# EAGLE design rs485if (EAGLE 6.5.0)
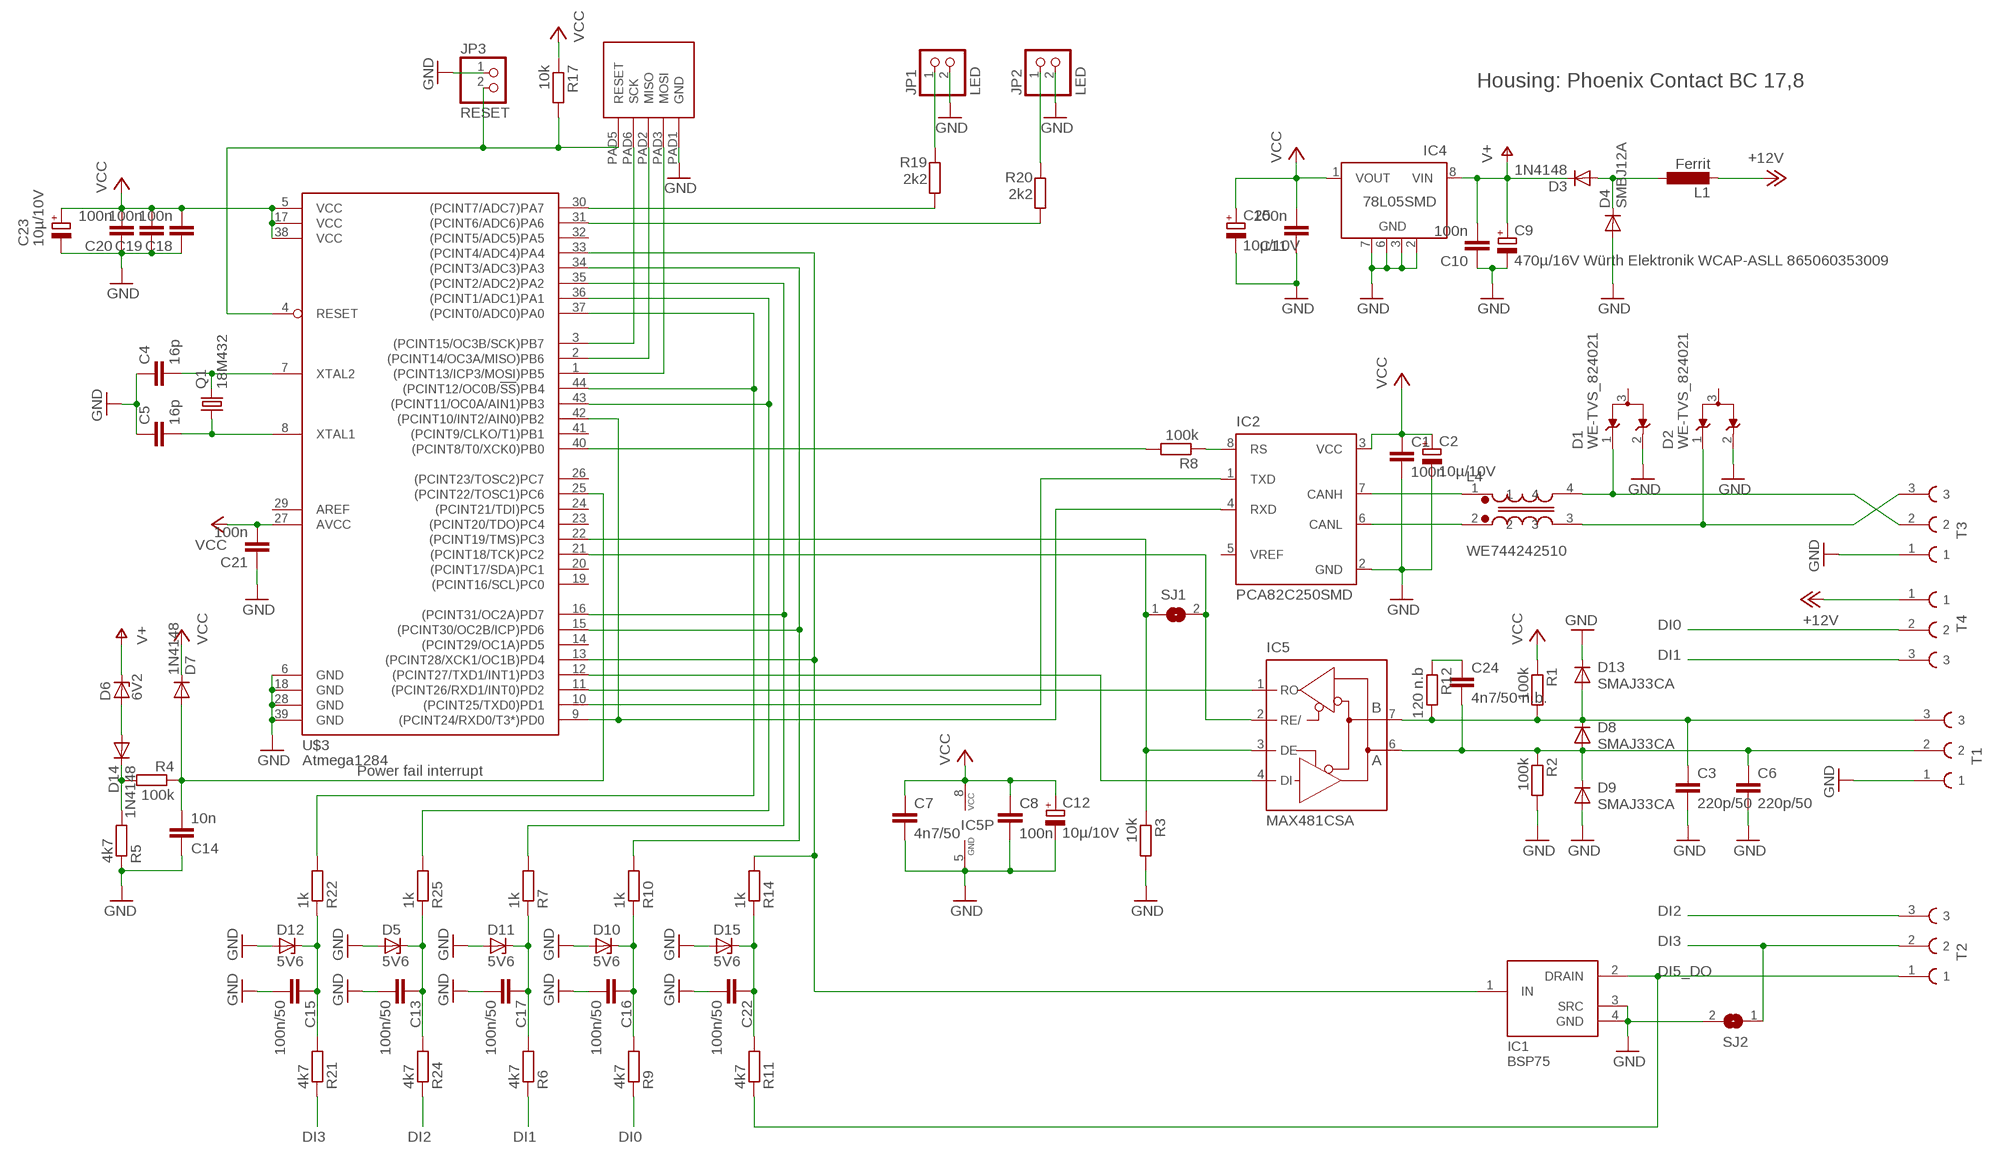
[diagram p0: schematic, sheet 1]

## Parts
C1  100n  C-EUC0603  [C0603]
C2  10µ/10V  CPOL-EUA/3216-18W  [A/3216-18W]
C3  220p/50  C-EUC0603  [C0603]
C4  16p  C-EUC0603  [C0603]
C5  16p  C-EUC0603  [C0603]
C6  220p/50  C-EUC0603  [C0603]
C7  4n7/50  C-EUC0603  [C0603]
C8  100n  C-EUC0603  [C0603]
C9  470µ/16V Würth Elektronik WCAP-ASLL 865060353009  CPOL-EUSANYO_SMD_E7  [SANYO-OSCON_SMD_E7]
C10  100n  C-EUC0603  [C0603]
C11  100n  C-EUC0603  [C0603]
C12  10µ/10V  CPOL-EUA/3216-18W  [A/3216-18W]
C13  100n/50  C-EUC0603  [C0603]
C14  10n  C-EUC0603  [C0603]
C15  100n/50  C-EUC0603  [C0603]
C16  100n/50  C-EUC0603  [C0603]
C17  100n/50  C-EUC0603  [C0603]
C18  100n  C-EUC0603  [C0603]
C19  100n  C-EUC0603  [C0603]
C20  100n  C-EUC0603  [C0603]
C21  100n  C-EUC0603  [C0603]
C22  100n/50  C-EUC0603  [C0603]
C23  10µ/10V  CPOL-EUA/3216-18W  [A/3216-18W]
C24  4n7/50 n.b.  C-EUC0603  [C0603]
C25  10µ/10V  CPOL-EUA/3216-18W  [A/3216-18W]
D1  WE-TVS_824021  [WE-TVS_SOT23-3L]
D2  WE-TVS_824021  [WE-TVS_SOT23-3L]
D3  1N4148  DIODE-SOD80C  [SOD80C]
D4  SMBJ12A  DIODE-SMB  [SMB]
D5  5V6  ZENER-DIODESOD80C  [SOD80C]
D6  6V2  ZENER-DIODESOD80C  [SOD80C]
D7  1N4148  DIODE-SOD80C  [SOD80C]
D8  SMAJ33CA  DIODE-DO214AC  [DO214AC]
D9  SMAJ33CA  DIODE-DO214AC  [DO214AC]
D10  5V6  ZENER-DIODESOD80C  [SOD80C]
D11  5V6  ZENER-DIODESOD80C  [SOD80C]
D12  5V6  ZENER-DIODESOD80C  [SOD80C]
D13  SMAJ33CA  DIODE-DO214AC  [DO214AC]
D14  1N4148  DIODE-SOD80C  [SOD80C]
D15  5V6  ZENER-DIODESOD80C  [SOD80C]
IC1  BSP75  [SOT223]
IC2  PCA82C250SMD  [SO8]
IC4  78L05SMD  [SO08]
IC5  MAX481CSA  [SO08]
JP1  LED  PINHD-1X2  [1X02]
JP2  LED  PINHD-1X2  [1X02]
JP3  RESET  PINHD-1X2  [1X02]
L1  Ferrit  L-EUL1806  [L1806]
L4  WE744242510  WE-SLM  [WE-SLM]
Q1  18M432  CRYSTALSM49  [SM49]
R1  100k  R-EU_R0603  [R0603]
R2  100k  R-EU_R0603  [R0603]
R3  10k  R-EU_R0603  [R0603]
R4  100k  R-EU_R0603  [R0603]
R5  4k7  R-EU_R0603  [R0603]
R6  4k7  R-EU_R0603  [R0603]
R7  1k  R-EU_R0603  [R0603]
R8  100k  R-EU_R0603  [R0603]
R9  4k7  R-EU_R0603  [R0603]
R10  1k  R-EU_R0603  [R0603]
R11  4k7  R-EU_R0603  [R0603]
R12  120 n.b  R-EU_R0603  [R0603]
R14  1k  R-EU_R0603  [R0603]
R17  10k  R-EU_R0603  [R0603]
R19  2k2  R-EU_R0603  [R0603]
R20  2k2  R-EU_R0603  [R0603]
R21  4k7  R-EU_R0603  [R0603]
R22  1k  R-EU_R0603  [R0603]
R24  4k7  R-EU_R0603  [R0603]
R25  1k  R-EU_R0603  [R0603]
SJ1  SJ  [SJ]
SJ2  SJ  [SJ]
T1  MKDSO_2.5/3_R  [PHOENIX_MKDSO_2.5/3_R]
T2  MKDSO_2.5/3_R  [PHOENIX_MKDSO_2.5/3_R]
T3  MKDSO_2.5/3_L  [PHOENIX_MKDSO_2.5/3_L]
T4  MKDSO_2.5/3_L  [PHOENIX_MKDSO_2.5/3_L]
U$1  ATMEL_ISP  [ATMEL_ISP]
U$3  Atmega1284  ATMEGA644  [TQFP44]

## Nets
#RESET: JP3.2 R17.2 U$1.PAD5(RESET) U$3.4(RESET)
+12V: L1.2 T4.1
A: C6.1 C24.2 D8.A D9.C IC5.6(A) R2.1 T1.2
B: C3.1 D8.C D13.A IC5.7(B) R1.2 R12.2 T1.3
B+: D1.1 L4.4 T3.2
B-: D2.1 L4.3 T3.3
DI0: R9.1 T4.2
DI1: R6.1 T4.3
DI2: R24.1 T2.3
DI3: R21.1 SJ2.1 T2.2
DI5_DO: IC1.2(DRAIN) R11.1 T2.1
GND: C1.2 C2.- C3.2 C4.1 C5.1 C6.2 C7.2 C8.2 C9.- C10.1 C11.1 C12.- C13.2 C14.1 C15.2 C16.2 C17.2 C18.1 C19.1 C20.1 C21.1 C22.2 C23.- C25.- D1.2 D2.2 D4.A D5.A D9.A D10.A D11.A D12.A D13.C D15.A IC1.3(SRC) IC1.4(GND) IC2.2(GND) IC4.2(GND) IC4.3(GND) IC4.6(GND) IC4.7(GND) IC5.5(GND) JP1.2 JP2.2 JP3.1 R2.2 R3.2 R5.1 SJ2.2 T1.1 T3.1 U$1.PAD1(GND) U$3.6(GND) U$3.18(GND) U$3.28(GND) U$3.39(GND)
N$1: R8.2 U$3.40((PCINT8/T0/XCK0)PB0)
N$2: C24.1 R12.1
N$3: IC2.1(TXD) U$3.10((PCINT25/TXD0)PD1)
N$5: U$1.PAD3(MOSI) U$3.1((PCINT13/ICP3/MOSI)PB5)
N$6: U$1.PAD2(MISO) U$3.2((PCINT14/OC3A/MISO)PB6)
N$7: U$1.PAD6(SCK) U$3.3((PCINT15/OC3B/SCK)PB7)
N$8: IC1.1(IN) R14.2 U$3.13((PCINT28/XCK1/OC1B)PD4) U$3.33((PCINT4/ADC4)PA4)
N$9: C13.1 D5.C R24.2 R25.1
N$10: IC2.7(CANH) L4.1
N$11: IC5.4(DI) U$3.12((PCINT27/TXD1/INT1)PD3)
N$12: IC2.4(RXD) U$3.9((PCINT24/RXD0/T3*)PD0) U$3.42((PCINT10/INT2/AIN0)PB2)
N$13: IC5.1(RO) U$3.11((PCINT26/RXD1/INT0)PD2)
N$14: IC5.3(DE) R3.1 SJ1.1 U$3.22((PCINT19/TMS)PC3)
N$15: C4.2 Q1.2 U$3.7(XTAL2)
N$16: C5.2 Q1.1 U$3.8(XTAL1)
N$17: IC2.6(CANL) L4.2
N$18: C15.1 D12.C R21.2 R22.1
N$19: C16.1 D10.C R9.2 R10.1
N$20: D3.A D4.C L1.1
N$21: C17.1 D11.C R6.2 R7.1
N$22: D6.A D14.A
N$23: JP2.1 R20.1
N$24: R19.2 U$3.30((PCINT7/ADC7)PA7)
N$25: R20.2 U$3.31((PCINT6/ADC6)PA6)
N$26: IC5.2(RE/) SJ1.2 U$3.21((PCINT18/TCK)PC2)
N$27: IC2.8(RS) R8.1
N$28: D14.C R4.2 R5.2
N$29: C22.1 D15.C R11.2 R14.1
N$33: R10.2 U$3.15((PCINT30/OC2B/ICP)PD6) U$3.34((PCINT3/ADC3)PA3)
N$34: R7.2 U$3.16((PCINT31/OC2A)PD7) U$3.35((PCINT2/ADC2)PA2)
N$35: R25.2 U$3.36((PCINT1/ADC1)PA1) U$3.43((PCINT11/OC0A/AIN1)PB3)
N$36: R22.2 U$3.37((PCINT0/ADC0)PA0) U$3.44((PCINT12/OC0B/!SS!)PB4)
N$37: JP1.1 R19.1
N$39: C14.2 D7.A R4.1 U$3.25((PCINT22/TOSC1)PC6)
V+: C9.+ C10.2 D3.C D6.C IC4.8(VIN)
VCC: C1.1 C2.+ C7.1 C8.1 C11.2 C12.+ C18.2 C19.2 C20.2 C21.2 C23.+ C25.+ D7.C IC2.3(VCC) IC4.1(VOUT) IC5.8(VCC) R1.1 R17.1 U$3.5(VCC) U$3.17(VCC) U$3.27(AVCC) U$3.38(VCC)
Unconnected: D1.3(GND) D2.3(GND) IC2.5(VREF) IC4.4(NC) IC4.5(NC) U$3.14((PCINT29/OC1A)PD5) U$3.19((PCINT16/SCL)PC0) U$3.20((PCINT17/SDA)PC1) U$3.23((PCINT20/TDO)PC4) U$3.24((PCINT21/TDI)PC5) U$3.26((PCINT23/TOSC2)PC7) U$3.29(AREF) U$3.32((PCINT5/ADC5)PA5) U$3.41((PCINT9/CLKO/T1)PB1)

## Notes on the sheet
- Housing: Phoenix Contact BC 17,8
- Power fail interrupt

## Library data of the parts
C1 C3-C8 C10 C11 C13-C22 C24 = resistor:C-EU: CAPACITOR, European symbol
C2 C9 C12 C23 C25 = rcl:CPOL-EU: POLARIZED CAPACITOR, European symbol
D1 D2 = EagleLibrary_Wuerth_Elektronik_eiSos_V6_20140807:WE-TVS_824021: TVS Diode Array WE-TVS, Standard Series - Low capazity - No leakage current - Low clamping voltage - high ESD voltage protection - Uni- and bidirectional protection -- DC Distribution -- Headsets and Accessoires -- PDAs -- Digital Cameras -- MP3-Players -- Touch Panels <http://katalog.we-online.de/media/images/eisos/VarTVS_highspeed_pf2.jpg.jpg> Details see: http://katalog.we-online.de/en/pbs/WE-TVS_High_Speed? Updated by Dan Xu 2014-07-11 2014 (C) Würth Elektronik
D3 D4 D7-D9 D13 D14 = diode:DIODE-: DIODE
D5 D6 D10-D12 D15 = diode:ZENER-DIODE: Z-Diode
IC1 = mylib:BSP75
IC2 = mylib:PCA82C250: CAN CONTROLLER INTERFACE
IC4 = linear:78L*SMD: Positive VOLTAGE REGULATOR
IC5 = maxim:MAX481CSA: RS485 TRANSEIVER; MF: MAXIM; MPN: MAX481CSA; OC_FARNELL: unknown; OC_NEWARK: 90C3817
JP1-JP3 = pinhead:PINHD-1X2: PIN HEADER
L1 = mylib:L-EU: INDUCTOR, European symbol
L4 = EagleLibrary_Wuerth_Elektronik_eiSos_V6_20140807:WE-SLM: SMD Common Mode Line Filter WE-SLM - Small size - Low Profile - High Impedance - High current capability up to 300 mA -- USB -- CAN -- Firewire -- Data Lines -- Power supply systems -- Signal Lines <http://katalog.we-online.de/media/images/eisos/IndSLM_pf2.jpg> Details see: http://katalog.we-online.de/en/pbs/WE-SLM?? Updated by Dan Xu 2014-07-11 2014 (C) Würth Elektronik
Q1 = crystal:CRYSTAL: CRYSTAL; OC_FARNELL: unknown; OC_NEWARK: unknown
R1-R12 R14 R17 R19-R22 R24 R25 = resistor:R-EU_: RESISTOR, European symbol
SJ1 SJ2 = jumper:SJ: SMD solder JUMPER
T1 T2 = mylib:MKDSO_2.5/3_R
T3 T4 = mylib:MKDSO_2.5/3_L
U$1 = mylib:ATMEL_ISP
U$3 = mylib:ATMEGA644

## Net classes
0 default: clearance 0.205 mm

## Board
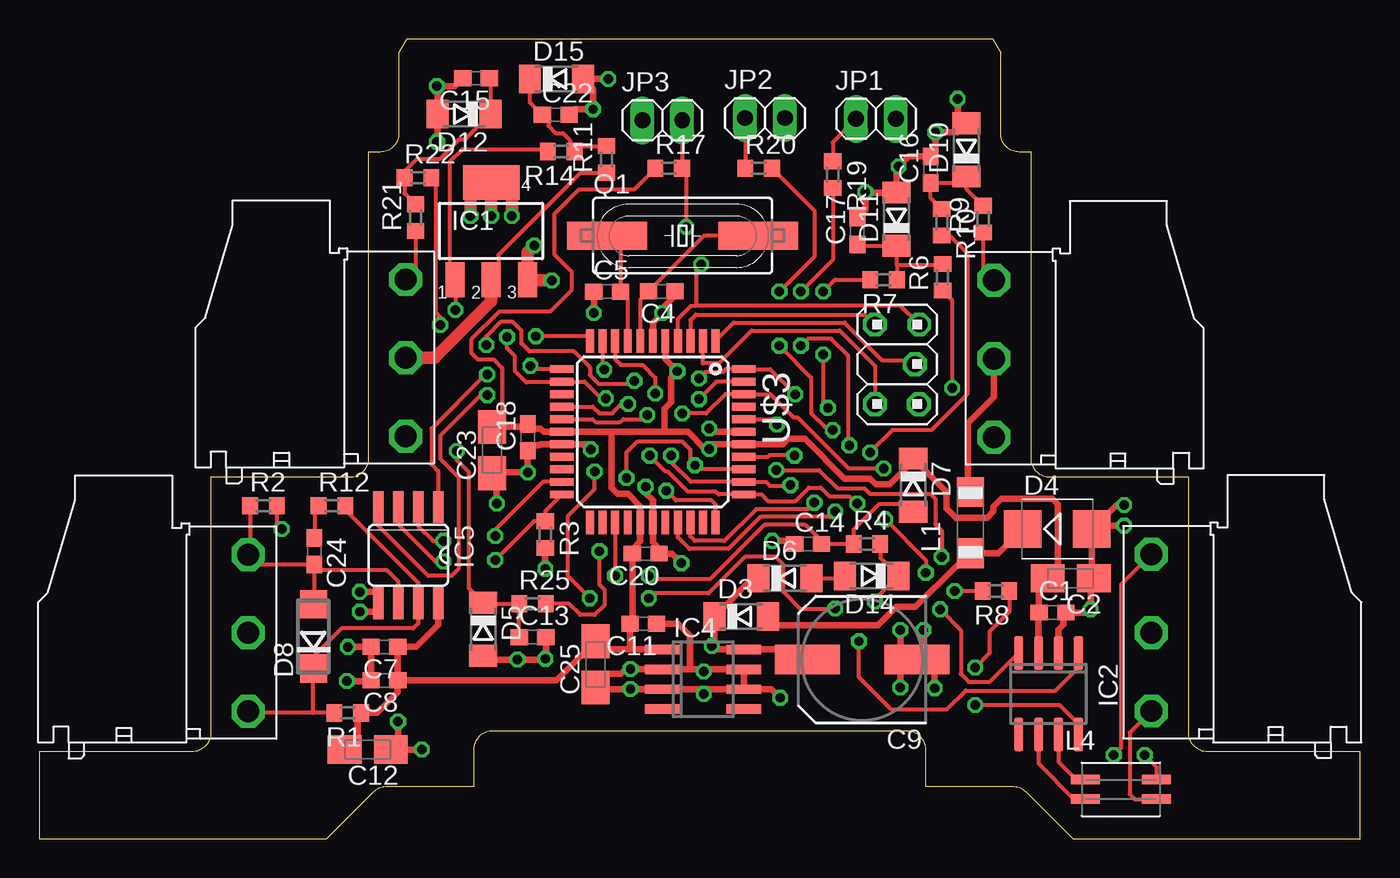
[diagram p1: board, top side]
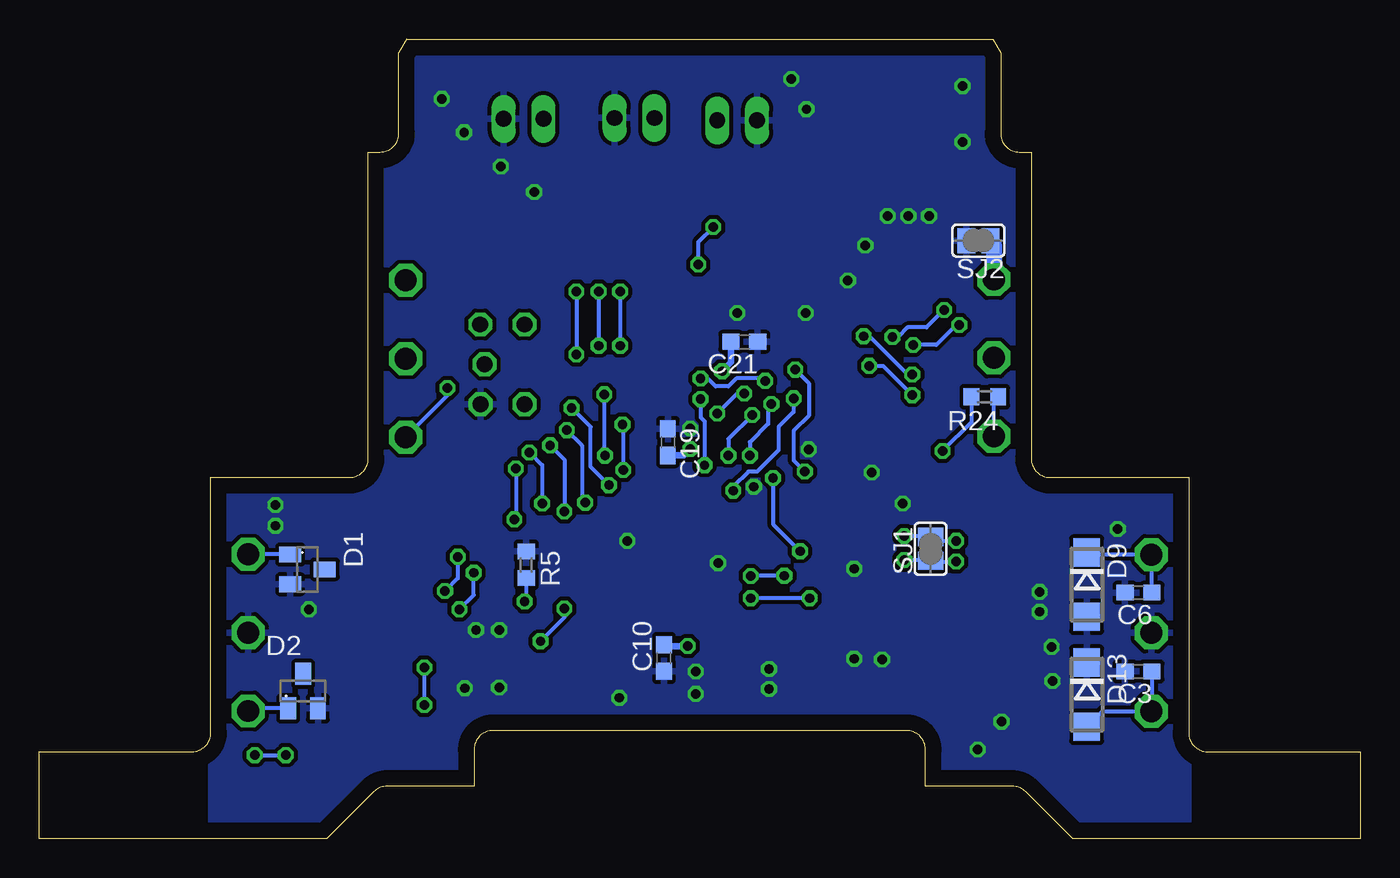
[diagram p2: board, bottom side, seen from below]

Size 84.3 x 51 mm. Coordinates in mm from the lower left corner, seen from the top.
Copper layers (1*16): Top 0.035mm / dielectric 1.5mm / Bottom 0.035mm
Design rules "Bilex DRU *": minimum track width 10mil, minimum drill 23mil, track to track 10mil, track to pad 10mil, pad to pad 10mil, via to via 10mil, smd to smd 10mil, copper to edge 40mil, drill to drill 8mil, minimum pad ring 10mil, minimum via ring 8mil, stop-mask expansion 4mil, vias tented up to drill 0mil, thermal gap 10mil

### Footprints (pad centres in the part's own frame; a part is rotated, then mirrored left to right if it is on the bottom)
C0603 = smd 1.1 x 1: 1 -0.85,0; 2 0.85,0
A/3216-18W = smd 2.15 x 1.8: + 1.475,0; - -1.475,0
SANYO-OSCON_SMD_E7 = smd 4.15 x 1.9: + 3.5,0; - -3.5,0
WE-TVS_SOT23-3L = smd 1 x 1.4: 1 -0.95,-1.1; 2 0.95,-1.1; 3 0,1.1
SOD80C = smd 1.4 x 1.8: A 1.7,0; C -1.7,0
SMB = smd 2.4 x 2.4: A 2.2,0; C -2.2,0
DO214AC = smd 1.8 x 1.7: A 2.05,0; C -2.05,0
SOT223 = smd 1.219 x 2.235: 1 -2.311,-3.099; 2 0,-3.099; 3 2.311,-3.099 | smd 3.6 x 2.2: 4 0,3.099
SO8 = smd 0.6 x 2.2: 1 -1.905,-2.6; 2 -0.635,-2.6; 3 0.635,-2.6; 4 1.905,-2.6; 5 1.905,2.6; 6 0.635,2.6; 7 -0.635,2.6; 8 -1.905,2.6
SO08 = smd 0.6 x 2.2: 1 -1.905,-2.6; 2 -0.635,-2.6; 3 0.635,-2.6; 4 1.905,-2.6; 5 1.905,2.6; 6 0.635,2.6; 7 -0.635,2.6; 8 -1.905,2.6
SO08' = smd 0.66 x 2.032: 1 -1.905,-3.073; 2 -0.635,-3.073; 3 0.635,-3.073; 4 1.905,-3.073; 5 1.905,3.073; 6 0.635,3.073; 7 -0.635,3.073; 8 -1.905,3.073
1X02 = drill 1.016 long: 1 -1.27,0; 2 1.27,0
L1806 = smd 1.9 x 1.7: 1 -0.68,0; 2 3.22,0
WE-SLM = smd 1.85 x 0.6: 1 -2.28,0.63; 2 -2.28,-0.62; 3 2.27,-0.62; 4 2.27,0.63
SM49 = smd 5.08 x 1.778: 1 -4.826,0; 2 4.826,0
R0603 = smd 1 x 1.1: 1 -0.85,0; 2 0.85,0
SJ = smd 1.168 x 1.6: 1 -0.762,0; 2 0.762,0
PHOENIX_MKDSO_2.5/3_R = drill 1.4 octagon: 1 7.1,-0.62; 2 7.1,4.38; 3 7.1,-5.62
PHOENIX_MKDSO_2.5/3_L = drill 1.4 octagon: 1 -7.1,-0.62; 2 -7.1,4.38; 3 -7.1,-5.62
ATMEL_ISP = drill 1.016 octagon: PAD1 1.397,-2.54; PAD2 -1.41,-2.54; PAD3 1.13,0; PAD5 1.41,2.54; PAD6 -1.41,2.54
TQFP44 = smd 1.5 x 0.5: 1 -5.8,4; 2 -5.8,3.2; 3 -5.8,2.4; 4 -5.8,1.6; 5 -5.8,0.8; 6 -5.8,0; 7 -5.8,-0.8; 8 -5.8,-1.6; 9 -5.8,-2.4; 10 -5.8,-3.2; 11 -5.8,-4; 23 5.8,-4; 24 5.8,-3.2; 25 5.8,-2.4; 26 5.8,-1.6; 27 5.8,-0.8; 28 5.8,0; 29 5.8,0.8; 30 5.8,1.6; 31 5.8,2.4; 32 5.8,3.2; 33 5.8,4 | smd 0.5 x 1.5: 12 -4,-5.8; 13 -3.2,-5.8; 14 -2.4,-5.8; 15 -1.6,-5.8; 16 -0.8,-5.8; 17 0,-5.8; 18 0.8,-5.8; 19 1.6,-5.8; 20 2.4,-5.8; 21 3.2,-5.8; 22 4,-5.8; 34 4,5.8; 35 3.2,5.8; 36 2.4,5.8; 37 1.6,5.8; 38 0.8,5.8; 39 0,5.8; 40 -0.8,5.8; 41 -1.6,5.8; 42 -2.4,5.8; 43 -3.2,5.8; 44 -4,5.8

### Placement (x,y rotation side)
C1  64.65,14.43 0 top
C2  65.82,16.61 180 top
C3  14.16,10.67 180 bottom
C4  39.73,34.92 180 top
C5  36.24,34.89 0 top
C6  14.16,15.7 180 bottom
C7  22.03,12.24 180 top
C8  22.03,10.11 180 top
C9  52.51,11.43 180 top
C10  44.44,11.53 90 bottom
C11  38.54,13.72 180 top
C12  20.97,5.69 180 top
C13  31.48,12.85 0 top
C14  49.06,18.8 0 top
C15  27.88,48.51 180 top
C16  56.88,42.67 90 top
C17  52.21,38.76 90 top
C18  31.18,25.6 90 top
C19  44.18,25.3 270 bottom
C20  38.7,18.19 180 top
C21  39.31,31.7 180 bottom
C22  32.96,46.18 0 top
C23  28.89,24.79 90 top
C24  17.56,18.34 270 top
C25  35.5,11.13 90 top
D1  67.18,17.18 270 bottom
D2  67.46,9.42 0 bottom
D3  44.79,14.17 0 top
D4  64.96,19.76 0 top
D5  28.33,13.36 270 top
D6  47.59,16.61 0 top
D7  55.76,22.56 270 top
D8  17.51,12.9 90 top
D9  17.46,16.21 270 bottom
D10  59.17,43.94 90 top
D11  54.7,39.52 90 top
D12  27.11,46.23 180 top
D13  17.46,9.19 270 bottom
D14  53.12,16.76 180 top
D15  33.01,48.46 0 top
IC1  28.84,38.76 0 top
IC2  64.4,9.25 180 top
IC4  42.37,10.17 270 top
IC5  MAX481CSA  [SO08']  23.56,18.08 180 top
JP1  53.4,45.92 0 top
JP2  46.32,45.97 0 top
JP3  39.76,45.82 0 top
L1  59.42,18.9 90 top
L4  69.02,3.15 0 top
Q1  41.06,38.47 0 top
R1  19.7,8.03 180 top
R2  14.31,21.23 0 top
R3  32.29,19.41 270 top
R4  52.82,18.8 0 top
R5  53.22,17.48 270 bottom
R6  57.64,35.81 90 top
R7  53.88,35.66 180 top
R8  61.05,15.8 180 top
R9  60.23,39.52 90 top
R10  57.59,39.32 270 top
R11  36.21,43.33 90 top
R12  18.68,21.23 0 top
R14  33.31,43.84 180 top
R17  40.17,42.77 0 top
R19  50.63,42.37 270 top
R20  45.91,42.77 0 top
R21  24.01,39.62 90 top
R22  24.17,42.16 0 top
R24  23.96,28.19 180 bottom
R25  31.48,14.99 0 top
SJ1  27.42,18.49 90 bottom
SJ2  24.37,38.15 180 bottom
T1  6.23,13.75 0 top
T2  16.29,31.29 0 top
T3  78.07,13.77 0 top
T4  68.01,31.24 0 top
U$1  54.74,30.26 0 top
U$3  39.15,25.96 270 top
U$4  [GEHÄUSE_PHOENIX_BC_17.8]  42.15,0 0 top

### Tracks (layer width: path | path; a pad name or v marks a point on that pad's centre or on a via)
#RESET  (via drill 0.6)
  Top 0.254: U$3.4 40.78,31.78 40.78,33.17 41.59,33.98 41.9,33.98 | JP3.2 41.02,45.81 R17.2 41.29,42.51 v41.29,39.01 | v42.25,36.63 41.9,36.27 41.9,33.98 | U$1.PAD5 54.97,33.98 41.9,33.98
  Bottom 0.254: v41.29,39.01 42.25,38.05 v42.25,36.63
+12V
  Top 0.406: T4.1 60.91,28.15 59.27,26.52 59.27,22.27 L1.2
A
  Top 0.254: C24.2 13.97,17.49 T1.2 13.46,18.25 R2.1 | IC5.6 22.92,16.38 22.19,17.12 17.56,17.12 C24.2 | D8.A 17.56,15 C24.2
  Bottom 0.254: 17.46,18.15 D9.C 17.33,18.13 T1.2 13.31,18.1 C6.1
B
  Top 0.254: R1.2 17.46,8.03 | 17.46,8.03 13.33,8.03 T1.3 | R12.2 19.53,20.99 24.19,16.33 IC5.7 24.19,13.74 23.86,13.41 19.29,13.41 17.51,11.63 D8.C 17.46,10.8 17.46,8.03
  Bottom 0.254: D13.A 16.46,8.15 13.35,8.15 T1.3 13.33,8.15 13.31,8.17 C3.1
B+  (via drill 0.6)
  Top 0.254: T3.2 69.02,16.2 69.02,5.79 v68.57,5.33 | v70.55,5.33 71.29,4.59 L4.4
  Bottom 0.254: D1.1 70.97,18.13 T3.2 | v70.55,5.33 v68.57,5.33
B-
  Top 0.254: T3.3 69.58,6.76 69.58,2.84 69.9,2.53 L4.3
  Bottom 0.254: 70.97,8.18 T3.3 70.8,8.32 D2.1
DI0
  Top 0.254: T4.2 60.23,36.29 R9.1
DI1  (via drill 0.6)
  Top 0.254: v58.25,28.75 58.25,34.35 R6.1
  Bottom 0.254: T4.3 58.25,28.28 v58.25,28.75
DI2
  Bottom 0.254: 23.42,25.67 T2.3 23.39,27.91 R24.1
DI3
  Top 0.254: R21.1 24.01,36.29 T2.2
  Bottom 1.016: SJ2.1 23.39,37.94 T2.2
DI5_DO
  Top 0.254: IC1.2 28.84,35.92 29.3,36.37 29.3,37.24 34.54,42.48 R11.1
  Top 0.813: IC1.2 28.84,34.29 25.22,30.67 T2.1
GND  (via drill 0.6)
  Top 0.254: R2.2 15.16,20.08 v15.48,19.76
  Top 0.406: v54.95,13.31 v54.95,9.65 | v57.14,9.6 57.14,11.02 | IC4.6 46.74,9.53 v47.28,8.99 | IC4.6 42.69,9.53 v42.4,9.25 | 41.54,10.8 IC4.2 37.73,10.8 v37.73,10.82 37.43,10.82 37.12,10.52 35.49,10.52 C25.- 35.59,9.55 v37.73,9.55 39.76,9.55 IC4.3 42.16,9.53 42.45,9.25 | 41.54,10.8 42.27,10.8 v42.4,10.67 42.54,10.8 IC4.7 IC4.6 | v25.39,44.45 25.41,44.48 D12.A 25.41,47.98 v25.39,48.01 26.52,48.01 C15.2 | C4.1 40.58,34.65 39.76,33.83 v39.76,33.53 39.15,32.92 U$3.6 | C5.1 v35.39,33.53 | C2.- | D4.A 67.16,16.75 C2.- | U$3.39 42.96,25.96 v42.76,26.16 | v38.7,22.45 38.7,22.05 39.15,21.59 U$3.28 39.15,18.9 39.55,18.5 C20.1 40.37,18.19 v40.98,17.58 | C13.2 32.33,11.52 v32.3,11.48 32.24,11.43 v30.52,11.43 28.33,11.43 D5.A | C11.1 40.78,13.72 41.54,12.95 41.54,10.8 | C14.1 48.01,19 v46.77,19 | v35.19,24.84 34.87,25.16 U$3.18 32,25.16 31.94,25.09 31.52,25.09 C18.1 v31.18,23.37 29.2,23.37 | v19.7,12.24 C7.2 C8.2 21.13,10.06 v19.65,10.06 | v20.46,14.48 21.65,14.48 IC5.5 21.65,15.75 v20.46,15.75 | v69.23,21.28 68.72,21.28 67.19,19.76 | v69.23,19.96 67.3,19.96 67.19,19.86 | R3.2 v32.3,17.22 | IC2.2 65.03,13.33 65.37,13.66 65.37,14.29 C1.2 66.89,14.43 v67.09,14.63 67.09,16.41 C2.- | C12.- 22.9,6.14 v22.9,7.47 | v24.42,5.69 C12.- | 29.2,23.37 28.89,23.37 C23.- | v29.2,21.39 29.2,23.37 | C17.2 52.72,40.12 v52.72,41.25 52.77,41.2 54.7,41.2 | D11.A 54.7,42.72 v54.85,42.87 55.5,43.52 C16.2 | v58.61,47.19 58.61,46.23 59.17,45.67 | 56.88,43.54 57.19,43.84 v57.19,45.06 58.59,45.06 D10.A | D15.A 35.34,47.83 v35.34,46.53 34.16,46.53 C22.2 | v36.31,48.46 34.73,48.46 | v56.42,13.31 56.42,11.56 56.86,11.12 | 57.19,11.02 57.14,11.02
  Top 0.406: 57.14,11.02 56.42,11.02 C9.-
  Top 0.813: v32.7,35.61 31.2,35.61 IC1.3 31.15,37.41 v31.58,37.85 | v27.52,39.73 27.52,41.86 IC1.4 | v28.84,39.73 IC1.4 | v30.16,39.73 30.16,41.86 IC1.4
  pour Bottom: 10.96,23.06 10.96,0 18.38,-0.05 21.78,3.35 27.77,3.35 27.77,6.1 28.54,6.86 55.66,6.86 56.63,5.89 56.63,3.35 62.67,3.35 65.98,0.05 73.34,0 73.34,23.06 64.3,23.06 63.33,24.03 63.33,43.79 62.17,43.79 61.3,44.65 61.3,50.39 60.69,51 23.71,51 22.95,50.24 22.95,44.6 22.03,43.69 21.07,43.69 21.07,23.93 20.2,23.06
N$1  (via drill 0.6)
  Top 0.254: U$3.40 46.73,26.76 v47.08,26.42 | v47.03,23.52 49.77,23.52 50.94,22.35 52.67,22.35 53.02,22 56.88,22 57.19,21.69 57.19,20.07 57.59,19.66 v57.59,17.98 | R8.2 v58.41,15.8
  Bottom 0.254: v47.03,23.52 47.03,26.36 v47.08,26.42 | v57.59,17.98 57.59,16.61 v58.41,15.8
N$2
  Top 0.254: R12.1 17.56,20.97 C24.1
N$3  (via drill 0.6)
  Top 0.254: v52.31,12.6 52.31,10.31 54.39,8.23 57.9,8.23 59.12,9.45 64.86,9.45 66.18,10.77 66.18,11.72 IC2.1 | v50.79,14.68 48.55,14.68 47.48,15.75 47.48,17.47 46.98,17.98 45.05,17.98 42.71,15.65 39.2,15.65 v38.9,15.34 | U$3.10 35.95,30.02 v36.05,29.92 | v35.44,23.42 35.44,22.3 33.72,20.57 33.72,16.76 v35.14,15.34
  Bottom 0.254: v50.79,14.68 50.79,14.12 v52.31,12.6 | v36.05,29.92 35.19,29.06 35.19,26.97 36.16,26.01 36.16,24.13 v35.44,23.42 | v35.14,15.34 v38.9,15.34
N$5
  Top 0.254: U$3.1 44.31,32.92 51.4,32.92 53.78,30.53 55.6,30.53 U$1.PAD3
N$6
  Top 0.254: U$1.PAD2 53.33,30.17 51.09,32.41 45.45,32.41 43.37,30.33 42.35,30.33 U$3.2
N$7
  Top 0.254: U$1.PAD6 53.29,32.8 52.67,33.43 41.9,33.43 41.55,33.08 U$3.3
N$8  (via drill 0.6)
  Top 0.254: U$3.13 | U$3.13 33.3,29.11 31.08,29.11 30.36,29.82 30.36,30.78 29.86,31.29 v29.86,32 | U$3.33 43.17,20.17 43.17,21.34 42.91,21.59 40.63,21.59 v40.02,22.2 | U$3.13 34.78,29.16 35.85,28.09 v36.16,28.09 | v26.55,33.73 26.55,35.64 IC1.1 26.2,35.99 26.2,43.18 27.01,43.99 32.31,43.99 R14.2
  Bottom 0.254: v36.16,28.09 36.16,27.23 37.12,26.26 37.12,24.79 38.49,23.42 39.05,23.42 40.02,22.45 v40.02,22.2 | v26.55,33.73 27.67,32.61 28.89,32.61 29.5,32 v29.86,32
N$9  (via drill 0.6)
  Top 0.254: C13.1 R25.1 28.33,14.99 D5.C 27.42,15.97 27.42,23.37 26.66,24.13 v26.66,24.74
  Bottom 0.254: R24.2 24.81,26.58 v26.66,24.74
N$10
  Top 0.254: IC2.7 65.03,4.9 66.16,3.78 L4.1
N$11  (via drill 0.6)
  Top 0.254: U$3.12 31.55,29.96 v31.34,30.16 | v28.59,28.3 28.18,28.3 25.59,25.7 25.59,24.23 26.76,23.06 26.76,17.22 26.3,16.76 24.83,16.76 21.65,19.94 IC5.4
  Bottom 0.254: v31.34,30.16 30.45,30.16 v28.59,28.3
N$12  (via drill 0.6)
  Top 0.254: v53.99,20.37 56.58,17.78 v56.58,16.97 | U$3.9 36.75,30.59 37.12,30.23 38.49,30.23 39.3,29.41 v39.3,28.4 | v41.03,27.13 42.56,27.13 43.79,28.36 U$3.42 46.66,28.36 48.14,26.87 48.4,26.87 51.65,23.62 v53.88,23.62 | v57.49,14.63 58.81,13.31 58.81,10.52 59.32,10.01 60.66,10.01 IC2.4
  Bottom 0.254: v53.88,23.62 53.88,20.47 v53.99,20.37 | v39.3,28.4 39.76,28.4 v41.03,27.13 | v57.49,14.63 56.58,15.54 v56.58,16.97
N$13  (via drill 0.6)
  Top 0.254: U$3.11 35.15,32.05 v31.68,32.05 | v28.59,29.62 28.48,29.62 25.03,26.16 25.03,23.88 25.46,23.44 IC5.1
  Bottom 0.254: v31.68,32.05 31.33,32.05 28.99,29.72 28.69,29.72 v28.59,29.62
N$14  (via drill 0.6)
  Top 0.254: IC5.3 22.92,20.04 25.28,17.68 v25.79,17.68 | v29.09,17.78 31.57,20.26 R3.1 32.3,20.9 U$3.22
  Bottom 0.254: v25.79,17.68 27.37,17.68 SJ1.1 27.47,17.78 v29.09,17.78
N$15
  Top 0.254: Q1.2 42.43,38.47 C4.2 38.35,34.39 U$3.7
N$16
  Top 0.254: Q1.1 37.09,38.47 C5.2 37.55,34.43 U$3.8
N$17
  Top 0.254: IC2.6 63.77,4.8 66.04,2.53 L4.2
N$18
  Top 0.254: R21.2 23.32,41.17 R22.1 23.32,42.58 24.12,43.38 25.59,43.38 26.81,44.6 27.19,44.6 D12.C 28.81,48.43 C15.1
N$19
  Top 0.254: R10.1 56.88,40.88 C16.1 58.75,41.82 D10.C 59.17,41.44 R9.2
N$20
  Top 0.406: D3.A 47.05,13.61 53.53,13.61 54.7,14.78 55.92,14.78 58.56,17.42 58.63,17.42 L1.1 61.22,18.22 D4.C
N$21
  Top 0.254: R6.2 57.56,36.58 54.73,36.58 | 54.73,36.58 R7.1 | 54.73,36.58 54.73,37.78 D11.C 52.3,37.82 C17.1
N$22
  Top 0.254: D6.A 51.27,16.61 D14.A
N$23
  Top 0.254: JP2.1 45.06,45.96 R20.1
N$24  (via drill 0.6)
  Top 0.254: v51.7,25.09 51.6,25.2 51.6,30.84 50.53,31.9 49.06,31.9 v48.6,31.44 | U$3.30 40.75,19.23 41.49,18.49 43.98,18.49 46.01,20.52 50.43,20.52 v50.79,20.88 | R19.2 50.63,36.93 v48.6,34.9
  Bottom 0.254: v48.6,34.9 v48.6,31.44 | v51.7,25.09 50.79,24.18 v50.79,20.88
N$25  (via drill 0.6)
  Top 0.254: R20.2 49.46,40.07 49.46,37.13 v47.23,34.9 | U$3.31 41.55,19.29 41.84,19 43.73,19 45.76,21.03 49.06,21.03 v49.46,21.44 | v47.23,31.44 49.26,29.41 49.26,27.13 50.13,26.26 50.43,26.26 v50.63,26.06
  Bottom 0.254: v47.23,34.9 v47.23,31.44 | v49.46,21.44 49.67,21.64 49.67,25.09 v50.63,26.06
N$26  (via drill 0.6)
  Top 0.254: U$3.21 32.14,22.76 29.09,19.71 v29.09,19.3 | IC5.2 24.19,19.94 25.13,19 v25.79,19
  Bottom 0.254: v25.79,19 27.16,19 SJ1.2 27.47,19.3 v29.09,19.3
N$27  (via drill 0.6)
  Top 0.254: v59.73,8.53 65.11,8.53 66.13,7.52 66.13,6.82 IC2.8 | R8.1 61.9,14.46 60.64,13.21 60.64,11.84 v59.73,10.92
  Bottom 0.254: v59.73,10.92 v59.73,8.53
N$28  (via drill 0.6)
  Top 0.254: R4.2 53.67,17.92 D14.C 53.33,15.27 v53.33,15.14
  Bottom 0.254: R5.2 53.22,15.24 v53.33,15.14
N$29
  Top 0.254: R11.2 34.5,44.18 R14.1 33.87,44.13 33.87,44.55 33.41,45.01 32.95,45.01 32.5,45.47 32.5,45.78 C22.1 31.31,46.98 D15.C
N$33  (via drill 0.6)
  Top 0.254: v53.02,24.64 54.44,26.06 56.93,26.06 59.22,28.35 59.22,37.35 58.1,38.47 R10.2 | v52.21,21.39 52.16,21.39 51.7,21.84 50.43,21.84 49.87,22.4 49.11,22.4 48.25,21.54 46.52,21.54 46.1,21.96 U$3.34 43.36,21.96 43.17,22.15 41.39,22.15 40.12,23.42 39.97,23.42 v38.95,24.43 | U$3.15 35.32,27.56 35.75,27.13 36.56,27.13 37.17,27.74 v37.58,27.74
  Bottom 0.254: v53.02,24.64 52.21,23.82 v52.21,21.39 | v37.58,27.74 37.78,27.53 37.78,26.47 38.95,25.3 v38.95,24.43
N$34  (via drill 0.6)
  Top 0.254: U$3.16 35.3,26.76 35.49,26.57 37.07,26.57 37.27,26.77 38.54,26.77 v38.8,27.03 | v40.32,24.43 40.32,24.03 41.59,22.76 U$3.35 46.37,22.76 46.62,22.5 47.89,22.5 v47.94,22.55 | v50.02,30.89 50.02,27.79 v50.33,27.48 | v50.02,34.9 50.79,35.66 R7.2
  Bottom 0.254: v50.02,34.9 v50.02,30.89 | v38.8,27.03 40.32,25.5 v40.32,24.43 | v47.94,22.55 49.11,23.72 49.11,26.26 v50.33,27.48
N$35  (via drill 0.6)
  Top 0.254: U$3.43 43.22,29.16 v42.1,28.04 | v37.48,23.01 37.48,24.64 38.19,25.35 41.03,25.35 41.54,24.84 41.54,24.13 v41.84,23.82 42.11,23.56 U$3.36 | v35.75,18.34 35.75,16.2 36.1,15.85 36.1,14.93 35.44,14.27 34.53,14.27 33.82,14.99 R25.2
  Bottom 0.254: v42.1,28.04 42.1,26.87 41.84,26.62 v41.84,23.82 | v37.48,23.01 37.48,20.07 v35.75,18.34
N$36  (via drill 0.6)
  Top 0.254: v28.54,31.5 28.54,32.05 29.45,32.97 30.21,32.97 30.77,32.41 30.77,31.6 31.28,31.09 34.12,31.09 35.14,30.07 35.14,29.57 35.7,29.01 37.78,29.01 v37.98,29.21 | v42.1,29.36 42.51,29.77 43.62,29.77 43.83,29.97 44.94,29.97 U$3.44 46.63,29.96 v48.25,28.35 | U$3.37 46.49,24.36 46.62,24.49 48.14,24.49 v48.2,24.43 | v25.59,32.77 25.59,33.27 25.28,33.58 25.28,41.9 R22.2
  Bottom 0.254: v37.98,29.21 38.14,29.36 39.81,29.36 40.32,28.85 41.13,28.85 41.64,29.36 v42.1,29.36 | v28.54,31.5 27.06,31.5 25.79,32.77 v25.59,32.77 | v48.25,28.35 48.25,24.49 v48.2,24.43
N$37
  Top 0.254: JP1.1 50.63,44.42 R19.1
N$39  (via drill 0.6)
  Top 0.254: D7.A 55.28,21.34 53.58,21.34 51.97,19.72 R4.1 C14.2 49.91,19.01 48.91,20.01 46.27,20.01 42.81,16.56 39.1,16.56 v38.9,16.76 | U$3.25 v36.75,16.78 36.77,16.76
  Bottom 0.254: v36.75,16.78 v38.89,16.78 v38.9,16.76
V+  (via drill 0.6)
  Top 0.406: D6.C 45.53,16.61 D3.C 43.09,12.47 v42.91,12.29 43.13,12.07 IC4.8 48.37,12.07 C9.+
  Bottom 0.406: C10.2 44.35,12.29 v42.91,12.29
VCC  (via drill 0.6)
  Top 0.254: R17.1 37.95,41.4 34.43,41.4 32.85,39.83 32.85,37.29 33.97,36.17 33.97,35 32.6,33.63 29.35,33.63 27.57,31.85 27.57,30.99 27.98,30.58 28.99,30.58 29.55,30.02 29.55,27.13
  Top 0.406: 36.51,25.96 U$3.17 32.19,25.96 31.99,26.16 31.63,26.16 31.34,26.45 C18.2 30.99,26.27 C23.+ 28.89,26.47 29.55,27.13 | 36.51,25.96 39.91,25.96 | 39.91,25.96 39.91,27.43 40.32,27.84 40.32,29.41 v40.73,29.82 39.95,30.59 U$3.5 | 39.91,25.96 41.39,25.96 42.49,24.85 v42.76,24.85 43.06,25.16 U$3.38 47.45,25.16 47.79,25.5 48.86,25.5 51.4,22.96 53.02,22.96 53.38,22.61 54.29,22.61 55.31,23.62 55.31,23.8 D7.C 57.9,22.12 57.9,21.08 58.51,20.47 60.49,20.47 60.9,20.88 60.9,21.18 61.4,21.69 64.65,21.69 65.01,21.34 65.01,17.17 64.91,17.17 C2.+ 63.8,16.07 C1.1 63.77,14.39 IC2.3 | 36.51,25.96 36.51,22.4 36.92,22 37.58,22 38.35,21.22 U$3.27 38.35,18.96 37.85,18.45 C20.2 37.85,13.87 C11.2 37.69,12.07 | IC4.1 37.69,12.07 | 37.69,12.07 36.02,12.07 C25.+ 33.01,10.11 C8.1 | IC5.8 25.46,13.64 24.07,12.24 C7.1 C8.1 | C8.1 22.95,10.04 | C8.1 22.88,9.33 21.58,8.03 R1.1 20.31,7.79 20.31,6.25 19.75,5.69 C12.+
  Bottom 0.406: C21.2 40.16,30.39 v40.73,29.82 | C19.2 43.16,24.45 v42.76,24.85